# EAGLE schematic Unicorn Light Meter (EAGLE 7.5.0)
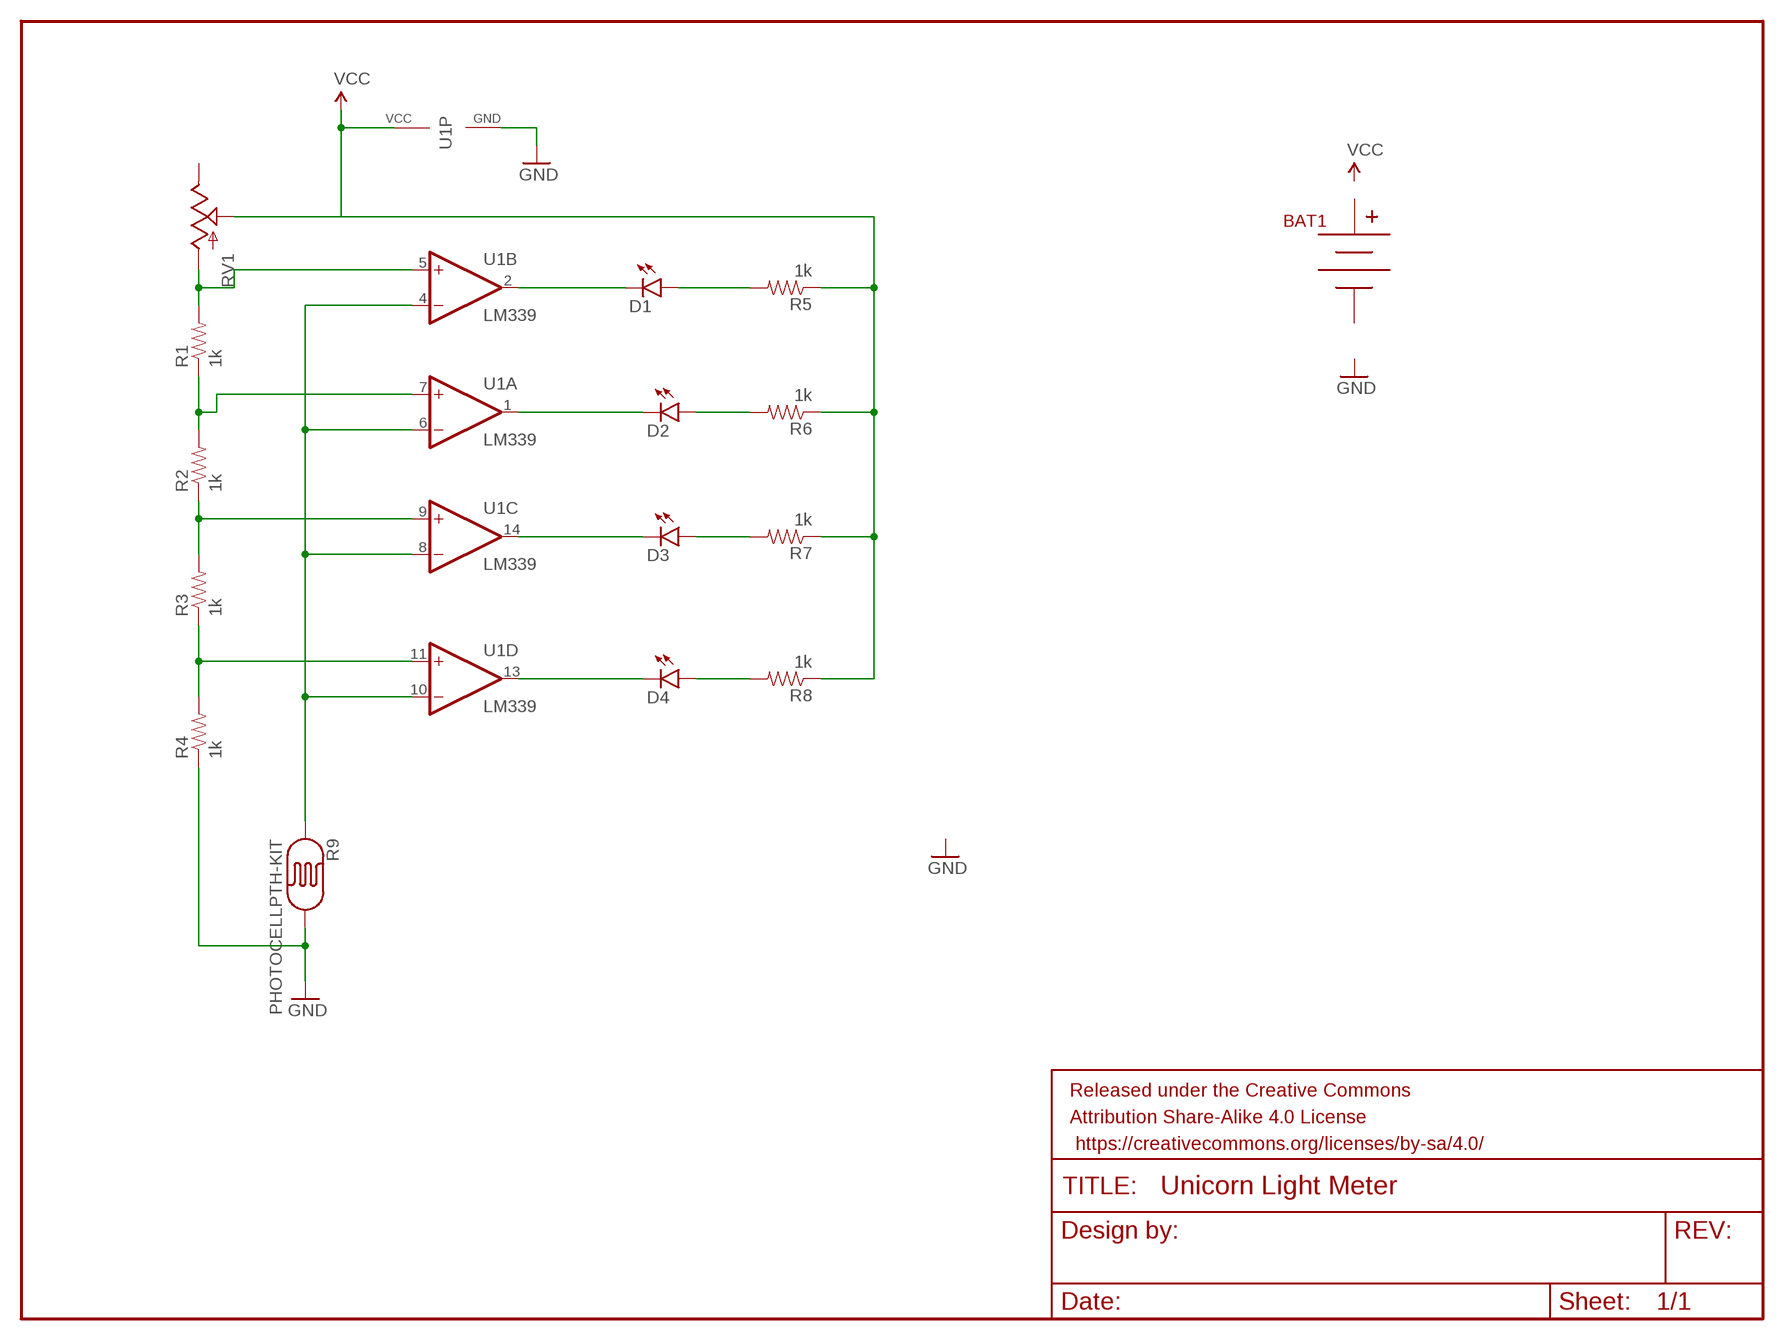
[diagram p0: schematic, sheet 1]

## Parts
BAT1  BC9VPCKIT_SOLDERMASK  [BC9VPC_KIT]
D1  LED5MM  [LED5MM]
D2  LED5MM  [LED5MM]
D3  LED5MM  [LED5MM]
D4  LED5MM  [LED5MM]
FRAME1  FRAME-LETTER  [CREATIVE_COMMONS]
R1  1k  1KOHM-1/4W-5%(PTH)HORIZ-KIT  [AXIAL-0.3EZ]
R2  1k  1KOHM-1/4W-5%(PTH)HORIZ-KIT  [AXIAL-0.3EZ]
R3  1k  1KOHM-1/4W-5%(PTH)HORIZ-KIT  [AXIAL-0.3EZ]
R4  1k  1KOHM-1/4W-5%(PTH)HORIZ-KIT  [AXIAL-0.3EZ]
R5  1k  1KOHM-1/4W-5%(PTH)HORIZ-KIT  [AXIAL-0.3EZ]
R6  1k  1KOHM-1/4W-5%(PTH)HORIZ-KIT  [AXIAL-0.3EZ]
R7  1k  1KOHM-1/4W-5%(PTH)HORIZ-KIT  [AXIAL-0.3EZ]
R8  1k  1KOHM-1/4W-5%(PTH)HORIZ-KIT  [AXIAL-0.3EZ]
R9  PHOTOCELLPTH-KIT  [PHOTOCELL-KIT]
RV1  POT100K_3362U  [3362U]
U1  LM339  [TSSOP-14]

## Nets
GND: R4.P$1 R9.2 U1.12(P:GND)
N$1: D2.A R6.P$2
N$2: D3.A R7.P$2
N$3: D4.K(C) U1.13(D:OUT)
N$5: D3.K(C) U1.14(C:OUT)
N$6: D1.K(C) U1.2(B:OUT)
N$7: D2.K(C) U1.1(A:OUT)
N$8: D1.A R5.P$2
N$9: D4.A R8.P$2
N$10: R1.P$2 RV1.P$3(A) U1.5(B:+IN)
N$11: R1.P$1 R2.P$2 U1.7(A:+IN)
N$12: R2.P$1 R3.P$2 U1.9(C:+IN)
N$13: R3.P$1 R4.P$2 U1.11(D:+IN)
N$16: R9.1 U1.4(B:-IN) U1.6(A:-IN) U1.8(C:-IN) U1.10(D:-IN)
VCC: R5.P$1 R6.P$1 R7.P$1 R8.P$1 RV1.P$2(S) U1.3(P:VCC)
Unconnected: BAT1.V+ BAT1.V- RV1.P$1(E)

## Library data of the parts
BAT1 = SparkFun-Connectors:BC9VPC: 9V board-mount battery cradle; PROD_ID: BATT-10855
D1-D4 = SparkFun-LED:LED: LEDs Standard schematic elements and footprints for 5mm, 3mm, 1206, and 0603 sized LEDs. 5mm - Spark Fun Electronics SKU : COM-00529 (and others)
FRAME1 = SparkFun-Aesthetics:FRAME-LETTER: Schematic Frame Standard 8.5x11 US Letter frame
R1-R8 = SparkFun-Resistors:1KOHM-1/4W-5%(PTH): RES-08380; PROD_ID: RES-08380
R9 = SparkFun-Sensors:PHOTOCELL: CdS photoresistor. This is a low cost way to detect light levels. Resistance decreases with more incoming light. SparkFun SKU: SEN-09088
RV1 = SparkFun-Electromechanical:POT
U1 = SparkFun-AnalogIC:LM339: Based on information from the SLCS006N datasheet from TI (www.ti.com). Change Log Date Author Change July 16, 2008 nick@scantool.net Device created.; DESC: IC, Quad Comparator; MANUF: Texas Instruments; PARTNUM: LM339PWR; SUPPLIER: Digikey:296-6607-1-ND; VALSTAT: PARTNUM